# EAGLE design Arm_Driver (EAGLE 6.1)
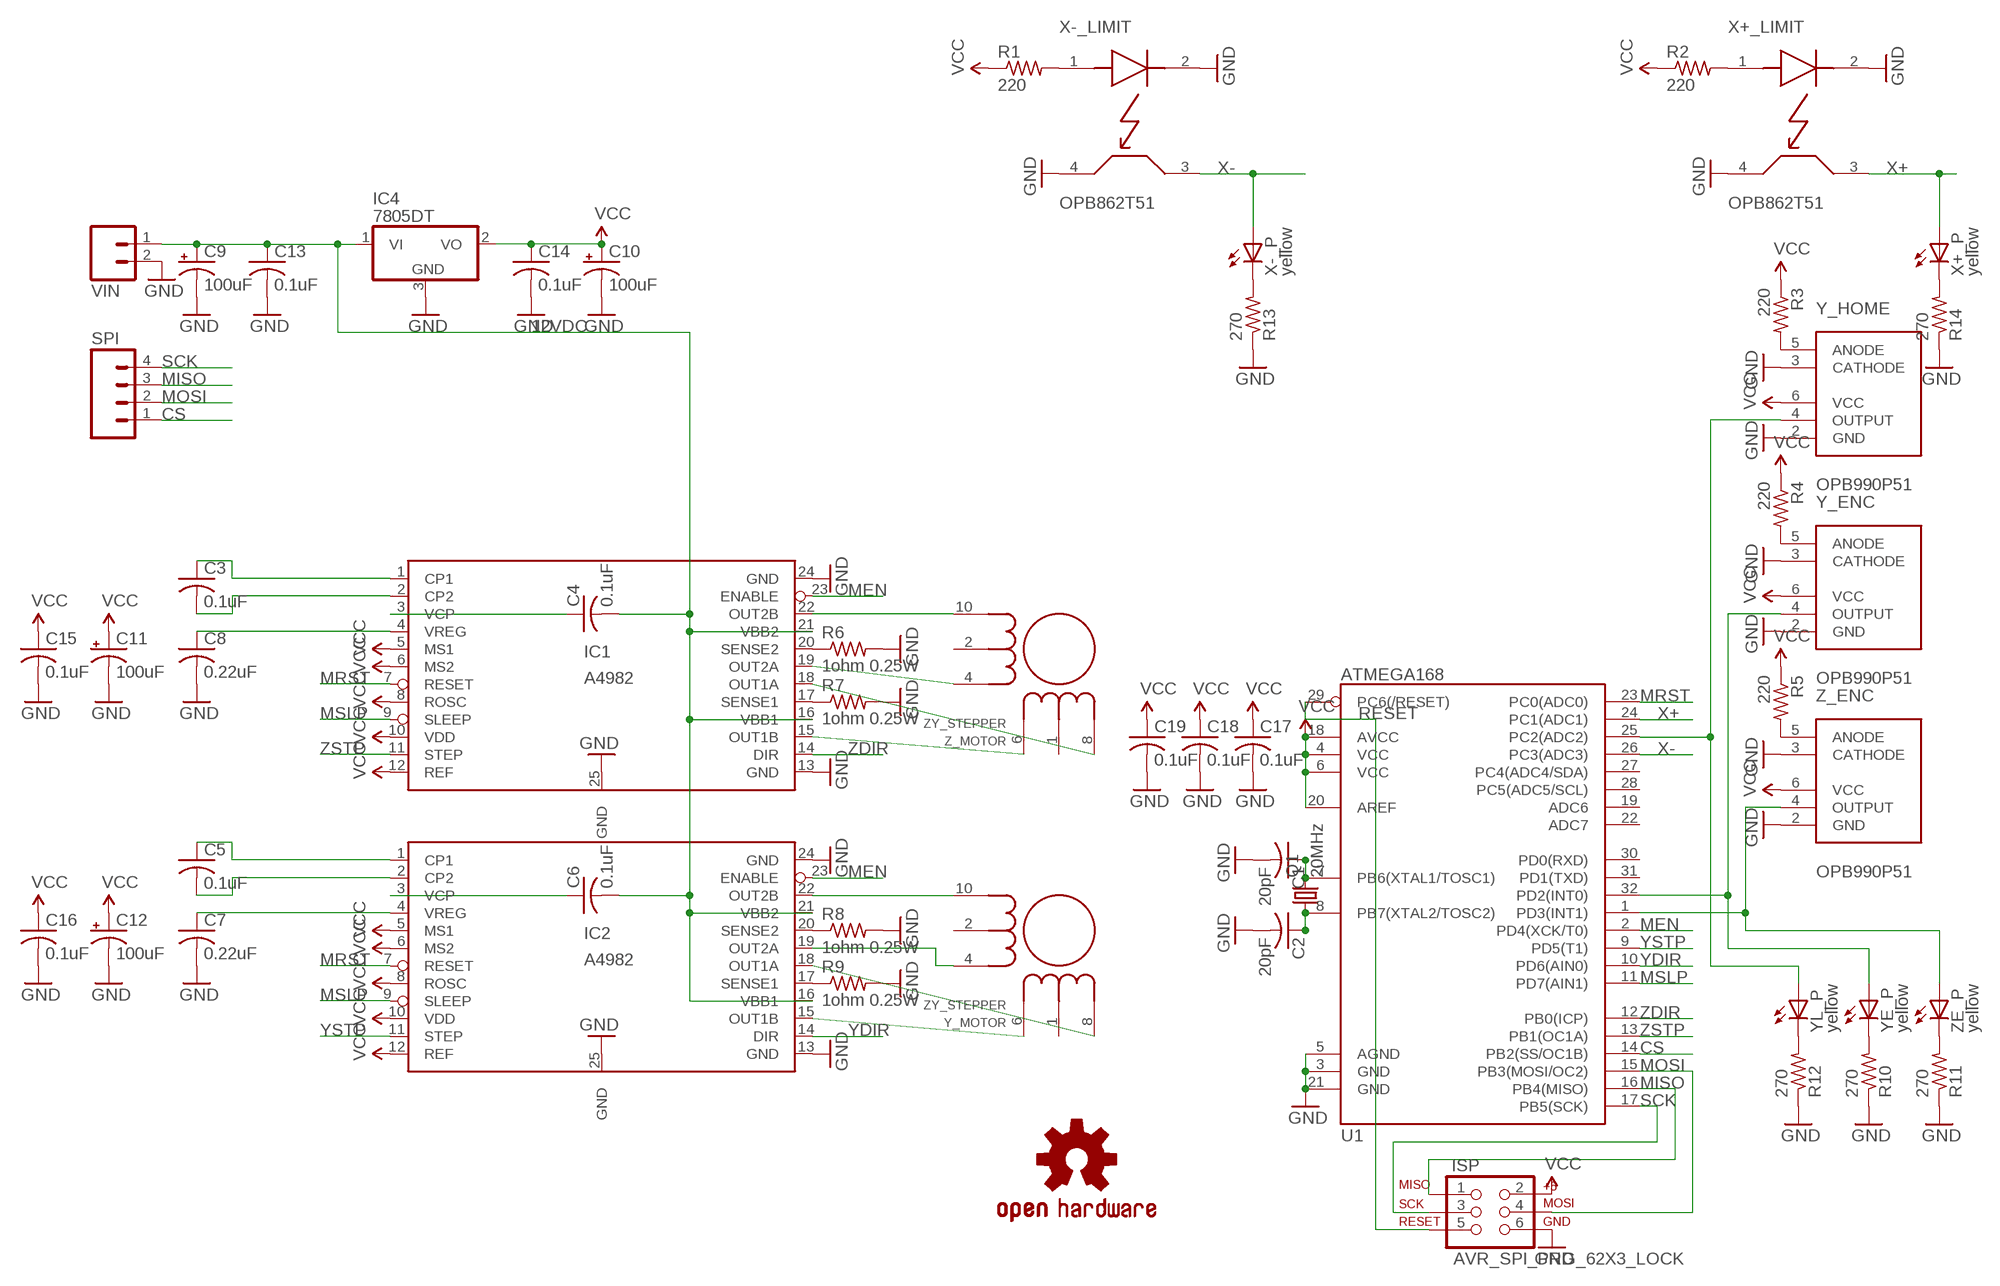
[diagram p0: schematic, sheet 1]

## Parts
C1  20pF  C-USC0603  [C0603]
C2  20pF  C-USC0603  [C0603]
C3  0.1uF  C-USC0603  [C0603]
C4  0.1uF  C-USC0603  [C0603]
C5  0.1uF  C-USC0603  [C0603]
C6  0.1uF  C-USC0603  [C0603]
C7  0.22uF  C-USC0603  [C0603]
C8  0.22uF  C-USC0603  [C0603]
C9  100uF  CPOL-US153CLV-0505  [153CLV-0505]
C10  100uF  CPOL-US153CLV-0505  [153CLV-0505]
C11  100uF  CPOL-US153CLV-0505  [153CLV-0505]
C12  100uF  CPOL-US153CLV-0505  [153CLV-0505]
C13  0.1uF  C-USC0603  [C0603]
C14  0.1uF  C-USC0603  [C0603]
C15  0.1uF  C-USC0603  [C0603]
C16  0.1uF  C-USC0603  [C0603]
C17  0.1uF  C-USC0603  [C0603]
C18  0.1uF  C-USC0603  [C0603]
C19  0.1uF  C-USC0603  [C0603]
IC1  A4982  [24TSSOP]
IC2  A4982  [24TSSOP]
IC4  7805DT  [TO252]
ISP  AVR_SPI_PRG_62X3_LOCK  [2X3_LOCK]
Q1  20MHz  CRYSTALHC49UP  [HC49UP]
R1  220  R-US_R0603  [R0603]
R2  220  R-US_R0603  [R0603]
R3  220  R-US_R0603  [R0603]
R4  220  R-US_R0603  [R0603]
R5  220  R-US_R0603  [R0603]
R6  1ohm 0.25W  R-US_R0603  [R0603]
R7  1ohm 0.25W  R-US_R0603  [R0603]
R8  1ohm 0.25W  R-US_R0603  [R0603]
R9  1ohm 0.25W  R-US_R0603  [R0603]
R10  270  R-US_R0603  [R0603]
R11  270  R-US_R0603  [R0603]
R12  270  R-US_R0603  [R0603]
R13  270  R-US_R0603  [R0603]
R14  270  R-US_R0603  [R0603]
SPI  M04LOCK  [1X04_LOCK]
U1  ATMEGA168  [TQFP32-08]
U$1  OSHW-LOGOM  [OSHW-LOGO-M]
VIN  M025MM  [SCREWTERMINAL-5MM-2]
X+_LIMIT  OPB862T51  [OPB862T51]
X+_P  yellow  LEDCHIP-LED0603  [CHIP-LED0603]
X-_LIMIT  OPB862T51  [OPB862T51]
X-_P  yellow  LEDCHIP-LED0603  [CHIP-LED0603]
Y_ENC  OPB990P51  [OPB990P51]
Y_HOME  OPB990P51  [OPB990P51]
Y_MOTOR  ZY_STEPPER  [2X5_SHROUDED]
YE_P  yellow  LEDCHIP-LED0603  [CHIP-LED0603]
YL_P  yellow  LEDCHIP-LED0603  [CHIP-LED0603]
Z_ENC  OPB990P51  [OPB990P51]
Z_MOTOR  ZY_STEPPER  [2X5_SHROUDED]
ZE_P  yellow  LEDCHIP-LED0603  [CHIP-LED0603]

## Nets
12VDC: C4.2 C6.2 C9.+ C13.1 IC1.16(VBB1) IC1.21(VBB2) IC2.16(VBB1) IC2.21(VBB2) IC4.1(VI) VIN.1
CS: SPI.1 U1.14(PB2(SS/OC1B))
GND: C1.2 C2.2 C7.2 C8.2 C9.- C10.- C11.- C12.- C13.2 C14.2 C15.2 C16.2 C17.2 C18.2 C19.2 IC1.13(GND) IC1.24(GND) IC1.25(GND) IC2.13(GND) IC2.24(GND) IC2.25(GND) IC4.3(GND) ISP.6 R6.2 R7.2 R8.2 R9.2 R10.1 R11.1 R12.1 R13.1 R14.1 U1.3(GND) U1.5(AGND) U1.21(GND) VIN.2 X+_LIMIT.2(CATHODE) X+_LIMIT.4(EMITTER) X-_LIMIT.2(CATHODE) X-_LIMIT.4(EMITTER) Y_ENC.2(GND) Y_ENC.3(CATHODE) Y_HOME.2(GND) Y_HOME.3(CATHODE) Z_ENC.2(GND) Z_ENC.3(CATHODE)
MEN: IC1.23(ENABLE) IC2.23(ENABLE) U1.2(PD4(XCK/T0))
MISO: ISP.1 SPI.3 U1.16(PB4(MISO))
MOSI: ISP.4 SPI.2 U1.15(PB3(MOSI/OC2))
MRST: IC1.7(RESET) IC2.7(RESET) U1.23(PC0(ADC0))
MSLP: IC1.9(SLEEP) IC2.9(SLEEP) U1.11(PD7(AIN1))
N$1: C1.1 Q1.2 U1.7(PB6(XTAL1/TOSC1))
N$2: C2.1 Q1.1 U1.8(PB7(XTAL2/TOSC2))
N$3: R1.2 X-_LIMIT.1(ANODE)
N$4: R2.2 X+_LIMIT.1(ANODE)
N$5: R3.2 Y_HOME.5(ANODE)
N$6: R4.2 Y_ENC.5(ANODE)
N$7: R5.2 Z_ENC.5(ANODE)
N$8: IC1.18(OUT1A) Z_MOTOR.8(A1)
N$9: U1.1(PD3(INT1)) Z_ENC.4(OUTPUT) ZE_P.A
N$10: U1.32(PD2(INT0)) Y_ENC.4(OUTPUT) YE_P.A
N$11: U1.25(PC2(ADC2)) Y_HOME.4(OUTPUT) YL_P.A
N$12: C5.1 IC2.1(CP1)
N$13: C5.2 IC2.2(CP2)
N$14: C3.1 IC1.1(CP1)
N$15: C3.2 IC1.2(CP2)
N$16: C4.1 IC1.3(VCP)
N$17: IC1.15(OUT1B) Z_MOTOR.6(A2)
N$18: C6.1 IC2.3(VCP)
N$19: IC1.19(OUT2A) Z_MOTOR.4(B1)
N$20: C8.1 IC1.4(VREG)
N$21: C7.1 IC2.4(VREG)
N$22: IC1.22(OUT2B) Z_MOTOR.10(B2)
N$23: IC2.18(OUT1A) Y_MOTOR.8(A1)
N$24: IC2.15(OUT1B) Y_MOTOR.6(A2)
N$25: IC2.22(OUT2B) Y_MOTOR.10(B2)
N$26: IC2.19(OUT2A) Y_MOTOR.4(B1)
N$29: IC1.20(SENSE2) R6.1
N$30: IC1.17(SENSE1) R7.1
N$31: IC2.20(SENSE2) R8.1
N$32: IC2.17(SENSE1) R9.1
N$33: R10.2 YE_P.C
N$35: R11.2 ZE_P.C
N$37: R12.2 YL_P.C
N$38: R13.2 X-_P.C
N$40: R14.2 X+_P.C
RESET: ISP.5 U1.29(PC6(/RESET))
SCK: ISP.3 SPI.4 U1.17(PB5(SCK))
VCC: C10.+ C11.+ C12.+ C14.1 C15.1 C16.1 C17.1 C18.1 C19.1 IC1.5(MS1) IC1.6(MS2) IC1.8(ROSC) IC1.10(VDD) IC1.12(REF) IC2.5(MS1) IC2.6(MS2) IC2.8(ROSC) IC2.10(VDD) IC2.12(REF) IC4.2(VO) ISP.2 R1.1 R2.1 R3.1 R4.1 R5.1 U1.4(VCC) U1.6(VCC) U1.18(AVCC) U1.20(AREF) Y_ENC.6(VCC) Y_HOME.6(VCC) Z_ENC.6(VCC)
X+: U1.24(PC1(ADC1)) X+_LIMIT.3(COLLECTOR) X+_P.A
X-: U1.26(PC3(ADC3)) X-_LIMIT.3(COLLECTOR) X-_P.A
YDIR: IC2.14(DIR) U1.10(PD6(AIN0))
YSTP: IC2.11(STEP) U1.9(PD5(T1))
ZDIR: IC1.14(DIR) U1.12(PB0(ICP))
ZSTP: IC1.11(STEP) U1.13(PB1(OC1A))
Unconnected: U1.19(ADC6) U1.22(ADC7) U1.27(PC4(ADC4/SDA)) U1.28(PC5(ADC5/SCL)) U1.30(PD0(RXD)) U1.31(PD1(TXD)) Y_MOTOR.1(CA) Y_MOTOR.2(CB) Z_MOTOR.1(CA) Z_MOTOR.2(CB)

## Library data of the parts
C1-C8 C13-C19 = rcl:C-US: CAPACITOR, American symbol
C9-C12 = rcl:CPOL-US: POLARIZED CAPACITOR, American symbol
IC1 IC2 = i3_Pick_Place:A4982: Allegro A4982 microstepping driver
IC4 = linear:78*: Positive VOLTAGE REGULATOR Source: http://cache.national.com/ds/LM/LM78L05.pdf http://www.fairchildsemi.com/ds/LM/LM7805.pdf
ISP = SparkFun:AVR_SPI_PRG_6: AVR ISP 6 Pin This is the reduced ISP connector for AVR programming. Common on Arduino. This footprint will take up less PCB space and can be used with a 10-pin to 6-pin adapter such as SKU: BOB-08508
Q1 = crystal:CRYSTAL: CRYSTAL; OC_FARNELL: unknown; OC_NEWARK: unknown
R1-R14 = rcl:R-US_: RESISTOR, American symbol
SPI = SparkFun:M04: Header 4 Standard 4-pin 0.1" header. Use with straight break away headers (SKU : PRT-00116), right angle break away headers (PRT-00553), swiss pins (PRT-00743), machine pins (PRT-00117), and female headers (PRT-00115). Molex polarized connector foot print use with SKU : PRT-08231 with associated crimp pins and housings. 1MM SMD Version SKU: PRT-10208
U1 = SparkFun:ATMEGA168
U$1 = SparkFun:OSHW-LOGO: Open Source Hardware Logo This logo indicates the piece of hardware it is found on incorporates a OSHW license and/or adheres to the definition of open source hardware found here: http://freedomdefined.org/OSHW
VIN = SparkFun:M02: Header 2 Standard 2-pin 0.1" header. Use with straight break away headers (SKU : PRT-00116), right angle break away headers (PRT-00553), swiss pins (PRT-00743), machine pins (PRT-00117), and female headers (PRT-00115). Molex polarized connector foot print use with SKU : PRT-08233 with associated crimp pins and housings.
X+_LIMIT X-_LIMIT = i3_Pick_Place:OPB862T51: Optek OPB862T51 PCB-mount IR opto-interrupter
X+_P X-_P YE_P YL_P ZE_P = adafruit:LED: LED OSRAM: - CHIPLED LG R971, LG N971, LY N971, LG Q971, LY Q971, LO R971, LY R971 LH N974, LH R974 LS Q976, LO Q976, LY Q976 LO Q996 - Hyper CHIPLED LW Q18S LB Q993, LB Q99A, LB R99A - SideLED LS A670, LO A670, LY A670, LG A670, LP A670 LB A673, LV A673, LT A673, LW A673 LH A674 LY A675 LS A676, LA A676, LO A676, LY A676, LW A676 LS A679, LY A679, LG A679 - Hyper Micro SIDELED® LS Y876, LA Y876, LO Y876, LY Y876 LT Y87S - SmartLED LW L88C, LW L88S LB L89C, LB L89S, LG L890 LS L89K, LO L89K, LY L89K LS L896, LA L896, LO L896, LY L896 - TOPLED LS T670, LO T670, LY T670, LG T670, LP T670 LSG T670, LSP T670, LSY T670, LOP T670, LYG T670 LG T671, LOG T671, LSG T671 LB T673, LV T673, LT T673, LW T673 LH T674 LS T676, LA T676, LO T676, LY T676, LB T676, LH T676, LSB T676, LW T676 LB T67C, LV T67C, LT T67C, LS T67K, LO T67K, LY T67K, LW E67C LS E67B, LA E67B, LO E67B, LY E67B, LB E67C, LV E67C, LT E67C LW T67C LS T679, LY T679, LG T679 LS T770, LO T770, LY T770, LG T770, LP T770 LB T773, LV T773, LT T773, LW T773 LH T774 LS E675, LA E675, LY E675, LS T675 LS T776, LA T776, LO T776, LY T776, LB T776 LHGB T686 LT T68C, LB T68C - Hyper Mini TOPLED® LB M676 - Mini TOPLED Santana® LG M470 LS M47K, LO M47K, LY M47K Source: http://www.osram.convergy.de/
Y_ENC Y_HOME Z_ENC = i3_Pick_Place:OPB990P51: Optek OPB990P51 flying-lead IR opto-interrupter
Y_MOTOR Z_MOTOR = i3_Pick_Place:ZY_STEPPER: Pinout for Z and Y steppers

## Board
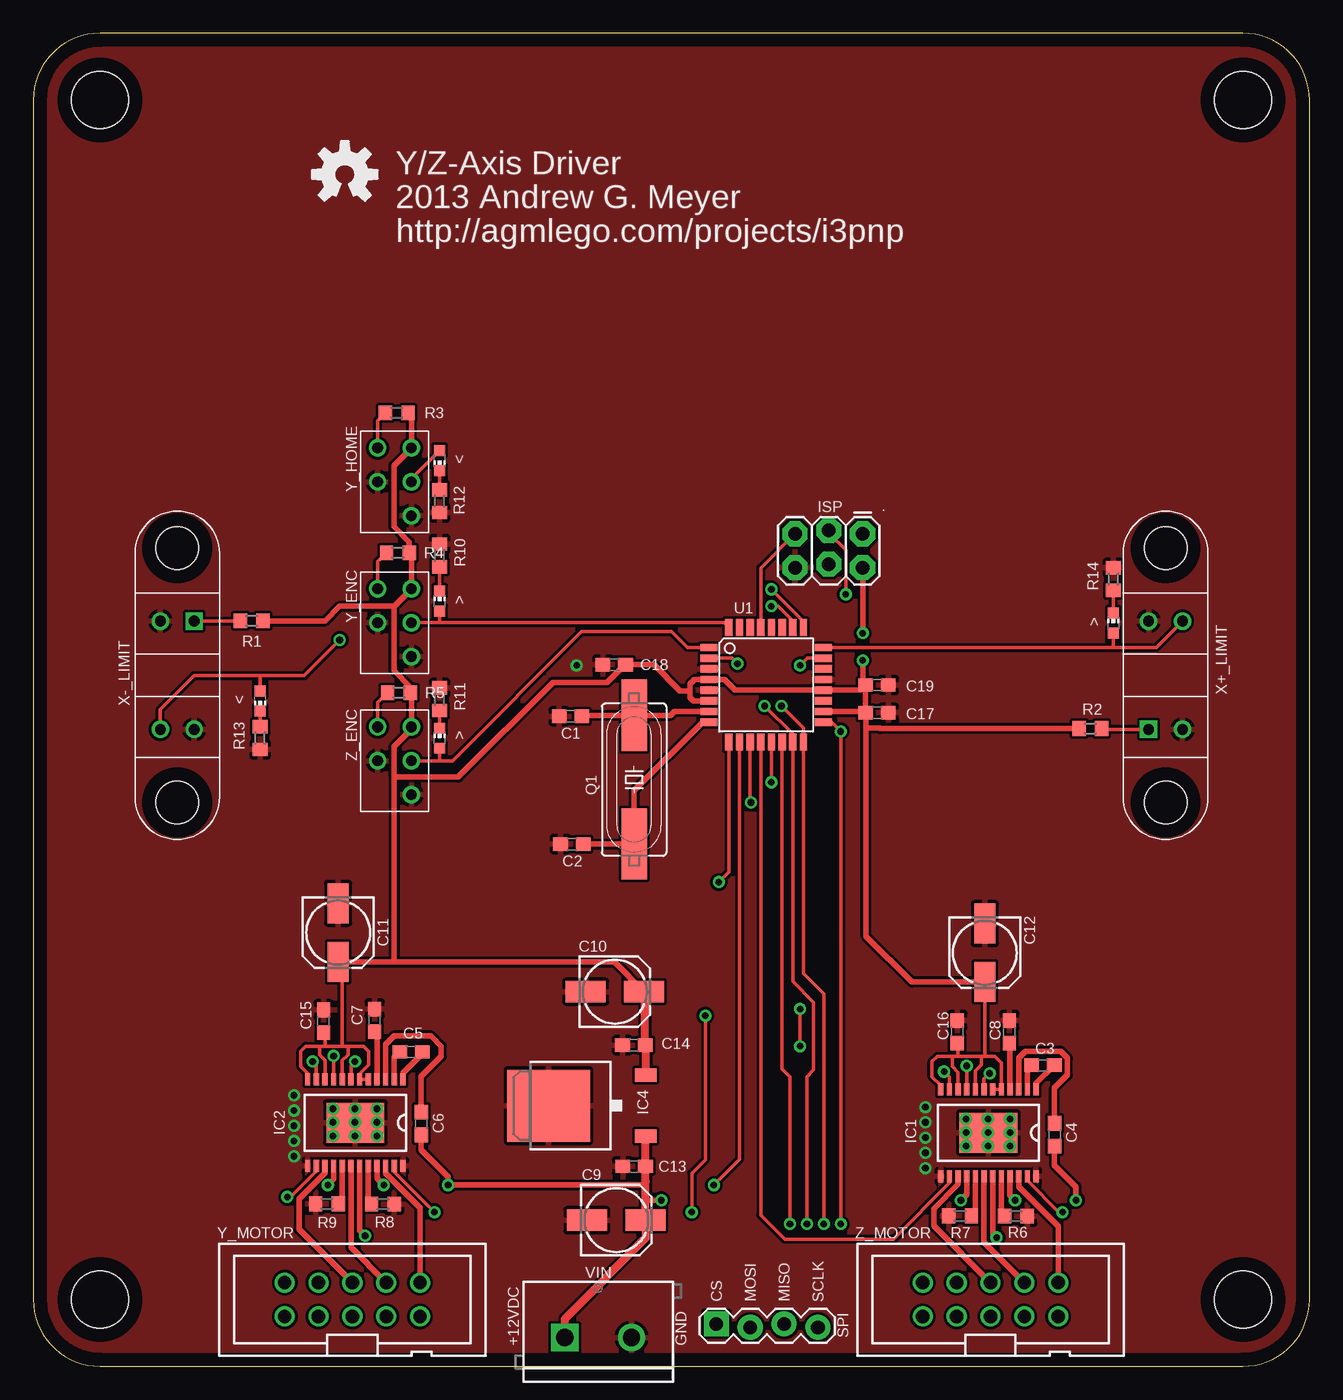
[diagram p1: board, top side]
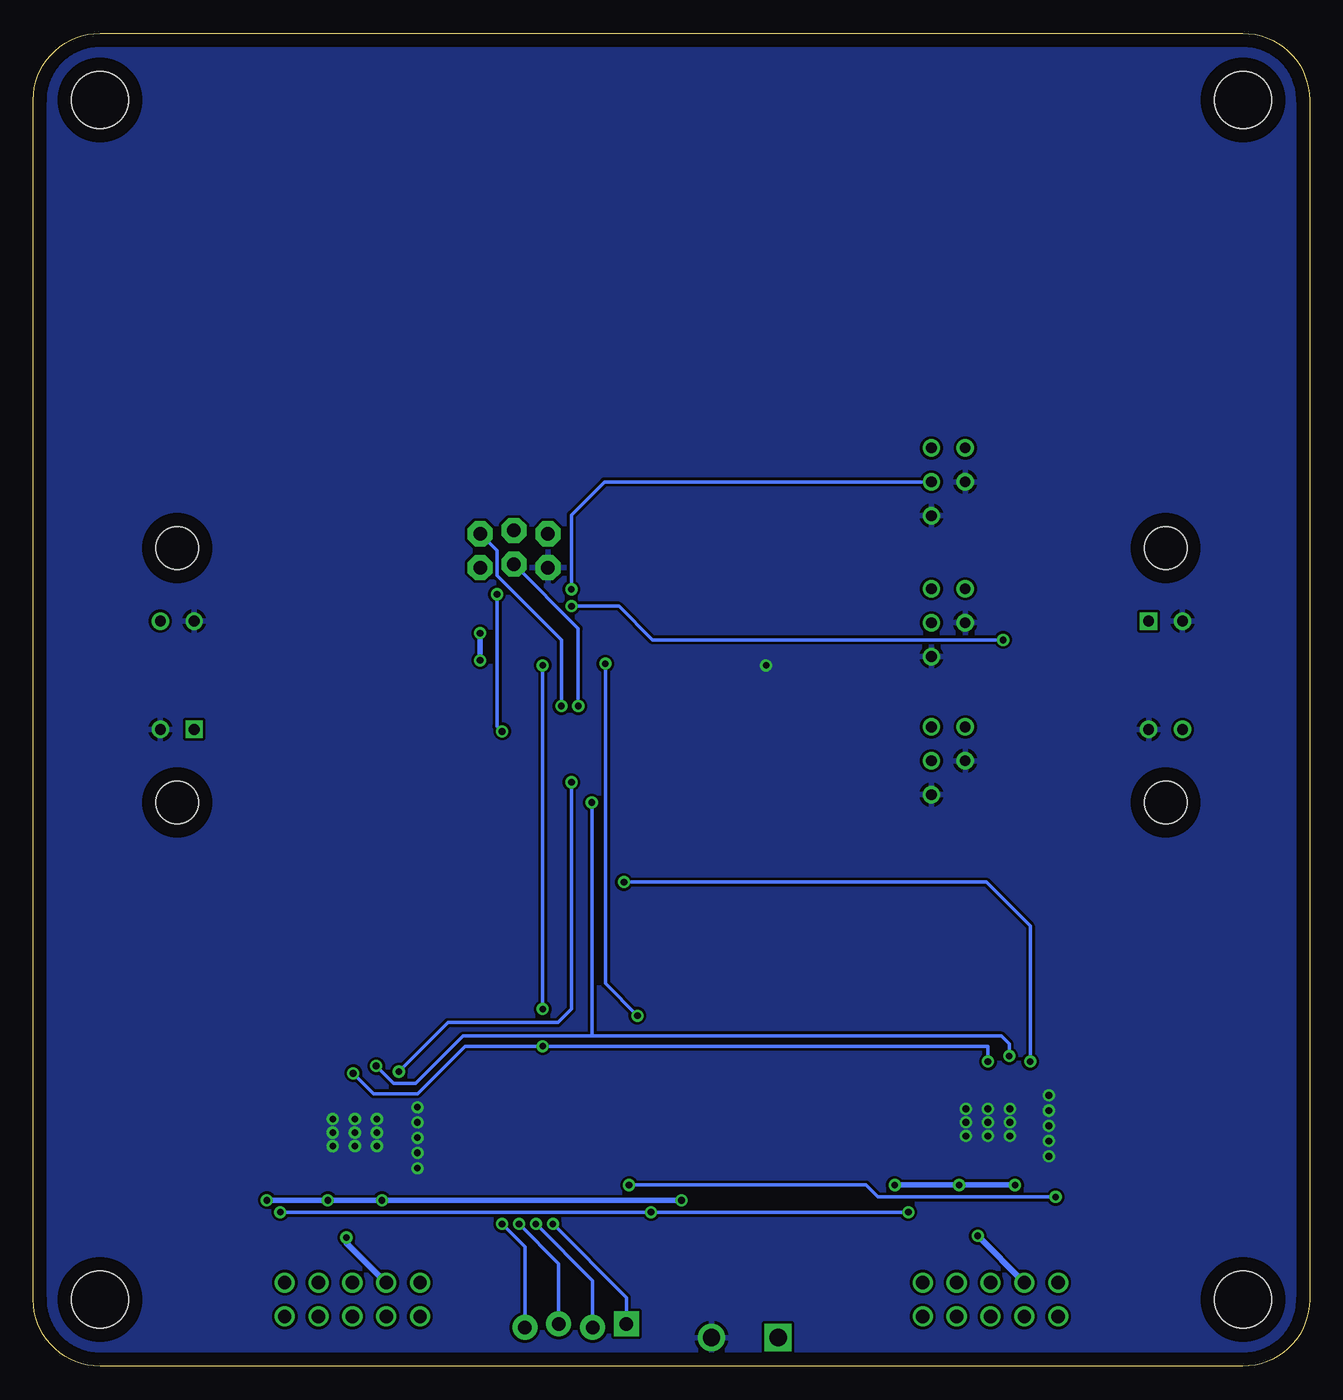
[diagram p2: board, bottom side, seen from below]

Size 95.75 x 100 mm. Coordinates in mm from the lower left corner, seen from the top.
Outline: 0,95 0,5 arc90 5,0 90.75,0 arc90 95.75,5 95.75,95 arc90 90.75,100 5,100 arc90 0,95
Copper layers (1*16): Top 0.035mm / dielectric 1.5mm / Bottom 0.035mm
Design rules: minimum track width 10mil, minimum drill 24mil, track to track 8mil, track to pad 8mil, pad to pad 8mil, via to via 8mil, smd to smd 8mil, copper to edge 40mil, drill to drill 8mil, minimum pad ring 10mil, minimum via ring 8mil, stop-mask expansion 4mil, vias tented up to drill 0mil, thermal gap 10mil
Holes 4.3 mm at 5,5 90.75,5 90.75,95 5,95

### Footprints (pad centres in the part's own frame; a part is rotated, then mirrored left to right if it is on the bottom)
C0603 = smd 1.1 x 1: 1 -0.85,0; 2 0.85,0
153CLV-0505 = smd 3 x 1.6: + 2.2,0; - -2.2,0
24TSSOP = smd 0.9 x 0.4: 1 -3.25,3.575; 2 -3.25,2.925; 3 -3.25,2.275; 4 -3.25,1.625; 5 -3.25,0.975; 6 -3.25,0.325; 7 -3.25,-0.325; 8 -3.25,-0.975; 9 -3.25,-1.625; 10 -3.25,-2.275; 11 -3.25,-2.925; 12 -3.25,-3.575; 13 3.25,-3.575; 14 3.25,-2.925; 15 3.25,-2.275; 16 3.25,-1.625; 17 3.25,-0.975; 18 3.25,-0.325; 19 3.25,0.325; 20 3.25,0.975; 21 3.25,1.625; 22 3.25,2.275; 23 3.25,2.925; 24 3.25,3.575 | smd 3 x 4.32: 25 0,0
TO252 = smd 1 x 1.6: 1 -2.28,-4.8; 2 2.28,-4.8 | smd 5.4 x 6.2: 3 0,2.5
2X3_LOCK = drill 1.016 pad 1.88 octagon: 1 0,0; 2 0,2.54; 3 2.54,-0.254; 4 2.54,2.286; 5 5.08,0; 6 5.08,2.54
HC49UP = smd 5.334 x 1.93: 1 -4.826,0; 2 4.826,0
R0603 = smd 1 x 1.1: 1 -0.85,0; 2 0.85,0
1X04_LOCK = drill 1.016 pad 1.88 square: 1 0,0.127 | drill 1.016 pad 1.88: 2 2.54,-0.127; 3 5.08,0.127; 4 7.62,-0.127
TQFP32-08 = smd 1.27 x 0.559: 1 -4.293,2.8; 2 -4.293,2; 3 -4.293,1.2; 4 -4.293,0.4; 5 -4.293,-0.4; 6 -4.293,-1.2; 7 -4.293,-2; 8 -4.293,-2.8; 17 4.293,-2.8; 18 4.293,-2; 19 4.293,-1.2; 20 4.293,-0.4; 21 4.293,0.4; 22 4.293,1.2; 23 4.293,2; 24 4.293,2.8 | smd 0.559 x 1.27: 9 -2.8,-4.293; 10 -2,-4.293; 11 -1.2,-4.293; 12 -0.4,-4.293; 13 0.4,-4.293; 14 1.2,-4.293; 15 2,-4.293; 16 2.8,-4.293; 25 2.8,4.293; 26 2,4.293; 27 1.2,4.293; 28 0.4,4.293; 29 -0.4,4.293; 30 -1.2,4.293; 31 -2,4.293; 32 -2.8,4.293
SCREWTERMINAL-5MM-2 = drill 1.3 pad 2.032 square: 1 0,0 | drill 1.3 pad 2.032: 2 5,0
OPB862T51 = drill 0.8 square: 1 4.064,-1.27 | drill 0.8: 2 4.064,1.27; 3 -4.064,1.27; 4 -4.064,-1.27 | hole 3.2: -9.538,0; 9.538,0
CHIP-LED0603 = smd 0.8 x 0.8: A 0,-0.75; C 0,0.75
OPB990P51 = drill 0.8: 2 -2.54,-1.27; 3 0,1.27; 4 0,-1.27; 5 2.54,1.27; 6 2.54,-1.27
2X5_SHROUDED = drill 1 pad 1.422: 1 -5.08,-1.27; 2 -5.08,1.27; 3 -2.54,-1.27; 4 -2.54,1.27; 5 0,-1.27; 6 0,1.27; 7 2.54,-1.27; 8 2.54,1.27; 9 5.08,-1.27; 10 5.08,1.27

### Placement (x,y rotation side)
C1  40.31,48.76 180 top
C2  40.41,39.17 180 top
C3  75.76,22.58 180 top
C4  76.62,17.37 270 top
C5  28.34,23.59 180 top
C6  29.11,18.2 270 top
C7  25.61,25.95 90 top
C8  73.23,25.08 90 top
C9  43.74,10.96 0 top
C10  43.63,28.09 0 top
C11  22.87,32.53 270 top
C12  71.39,31.02 270 top
C13  45.08,14.99 180 top
C14  45.06,24.09 180 top
C15  21.78,25.88 90 top
C16  69.32,25.09 90 top
C17  63.3,49.03 0 top
C18  43.58,52.63 180 top
C19  63.3,51.1 0 top
IC1  71.66,17.51 270 top
IC2  24.16,18.27 270 top
IC4  41.15,19.55 90 top
ISP  62.23,62.45 180 top
Q1  45.08,44.01 90 top
R1  16.38,55.92 180 top
R2  79.31,47.84 0 top
R3  27.27,71.53 180 top
R4  27.35,61.03 180 top
R5  27.43,50.53 180 top
R6  73.72,11.26 0 top
R7  69.53,11.28 180 top
R8  26.23,12.16 0 top
R9  22.03,12.18 180 top
R10  30.48,60.83 270 top
R11  30.48,50.04 270 top
R12  30.48,64.9 90 top
R13  17.02,47.12 90 top
R14  81.03,59.05 270 top
SPI  51.25,3.04 0 top
U1  54.98,51.12 0 top
U$1  23.37,89.41 0 top
VIN  39.88,2.15 0 top
X+_LIMIT  84.95,51.84 270 top
X+_P  81.03,55.75 0 top
X-_LIMIT  10.8,51.84 90 top
X-_P  17.02,49.91 180 top
Y_ENC  27.1,55.78 90 top
Y_HOME  27.1,66.35 90 top
Y_MOTOR  23.94,5 0 top
YE_P  30.48,57.4 0 top
YL_P  30.48,67.94 180 top
Z_ENC  27.1,45.42 90 top
Z_MOTOR  71.81,5 0 top
ZE_P  30.48,47.12 0 top

### Tracks (layer width: path | path; a pad name or v marks a point on that pad's centre or on a via)
12VDC  (via drill 0.5, 0.5 pad 0.25)
  Top 0.406: IC2.16 22.54,14.03 v22.1,13.59 | v26.29,13.59 25.79,14.09 IC2.21 | 45.94,13.84 45.69,13.59 v31.11,13.59 31.11,14.22 29.11,16.23 C6.2 | IC1.21 73.28,12.82 v73.66,12.45 | v69.6,12.45 70.03,12.88 IC1.16 | v47.12,12.45 45.94,12.45 | C4.2 76.62,15.07 78.23,13.46 v78.23,12.45
  Top 0.61: VIN.1 39.88,3.55 45.94,9.62 C9.+ 45.94,12.45 45.94,13.84 45.94,14.98 C13.1 45.93,17.25 IC4.1
  Bottom 0.406: v22.1,13.59 v26.29,13.59 v31.11,13.59 | v47.12,12.45 v69.6,12.45 v73.66,12.45 v78.23,12.45
CS  (via drill 0.5)
  Top 0.254: v56.77,10.67 56.77,21.72 56.18,22.31 U1.14
  Bottom 0.254: SPI.1 51.25,5.15 v56.77,10.67
GND  (via drill 0.5)
  other vias: 22.48,19.3 24.13,19.3 25.78,19.3 25.78,18.29 24.13,18.29 22.48,18.29 22.48,17.27 24.13,17.27 25.78,17.27 19.56,20.32 19.56,19.18 19.56,18.03 19.56,16.89 19.56,15.75 40.77,52.58 66.93,19.43 66.93,18.29 66.93,17.14 66.93,16 66.93,14.86 69.98,18.54 73.28,18.54 73.28,16.51 69.98,16.51 69.98,17.53 71.63,18.54 73.28,17.53 71.63,16.51 71.63,17.53
  pour Top: 0,0 95.75,0 95.75,100 0,100
  pour Bottom: 0,0 95.75,0 95.75,100 0,100
MEN  (via drill 0.5, 0.5 pad 0.25)
  Top 0.254: IC2.23 27.09,14.57 v30.1,11.56 | IC1.23 74.58,13.93 76.96,11.56 v77.22,11.56 | U1.2 52.42,53.12 v52.83,52.7 | v50.42,26.29 50.42,15.49 49.4,14.48 v49.4,11.56
  Bottom 0.254: v77.22,11.56 v49.4,11.56 v30.1,11.56 | v52.83,52.7 52.83,28.7 v50.42,26.29
MISO  (via drill 0.5)
  Top 0.254: v59.31,10.67 59.31,27.94 57.78,29.47 U1.16 57.78,47.88 v56.13,49.53
  Bottom 0.254: SPI.3 56.33,7.69 v59.31,10.67 | v56.13,49.53 56.13,54.48 60.96,59.31 60.96,61.19 ISP.1
MOSI  (via drill 0.5)
  Top 0.254: v58.04,10.67 58.04,21.72 58.55,22.23 58.55,27.3 56.98,28.87 U1.15 56.98,47.41 v54.86,49.53
  Bottom 0.254: SPI.2 53.79,6.42 v58.04,10.67 | v54.86,49.53 54.86,55.34 ISP.4
MRST  (via drill 0.5, 0.5 pad 0.25)
  Top 0.254: IC2.7 23.84,22.57 v24.13,22.86 | IC1.7 71.33,21.55 v71.75,21.97 | U1.23 58.07,53.12 v57.53,52.58 | v57.53,26.8 v57.53,24
  Bottom 0.254: v24.13,22.86 24.13,24 v57.53,24 63.37,24 66.93,20.45 70.23,20.45 v71.75,21.97 | v57.53,52.58 v57.53,26.8
MSLP  (via drill 0.5, 0.5 pad 0.25)
  Top 0.254: IC2.9 v22.54,23.26 v22.53,23.27 | IC1.9 v70.03,22.52 v70.03,22.53 | U1.11 53.78,42.36 v53.85,42.29
  Bottom 0.254: v70.03,22.53 68.71,21.21 67.06,21.21 63.5,24.77 53.85,24.77 | v53.85,42.29 53.85,24.77 | v22.53,23.27 22.53,24.18 23.11,24.77 53.85,24.77
N$1
  Top 0.406: C1.1 41.23,48.84 Q1.2 47.82,48.84 48.1,49.12 U1.7
N$2
  Top 0.406: U1.8 50.23,48.32 45.09,43.18 Q1.1 C2.1
N$3
  Top 0.254: X-_LIMIT.1 15.51,55.9 R1.2
N$4
  Top 0.254: X+_LIMIT.1 80.23,47.77 R2.2
N$5
  Top 0.254: Y_HOME.5 25.83,70.94 R3.2
N$6
  Top 0.254: Y_ENC.5 25.83,60.36 R4.2
N$7
  Top 0.254: Z_ENC.5 25.83,49.78 R5.2
N$8
  Top 0.406: IC1.18 71.33,9.29 Z_MOTOR.8
N$9
  Top 0.254: Z_ENC.4 30.48,45.42 | 30.48,45.42 31.45,45.42 41.15,55.12 47.88,55.12 49.08,53.92 U1.1 | ZE_P.A 30.48,45.42
N$10
  Top 0.254: Y_ENC.4 30.61,55.78 | 30.61,55.78 51.81,55.78 U1.32 | YE_P.A 30.48,55.91 30.61,55.78
N$11  (via drill 0.5)
  Top 0.254: 55.37,58.29 v55.38,58.28 57.78,55.88 U1.25 | Y_HOME.4 28.37,66.58 YL_P.A
  Bottom 0.254: Y_HOME.4 52.9,66.35 55.38,63.87 v55.38,58.28
N$12
  Top 0.406: C5.1 29.19,23.47 27.73,22.02 IC2.1
N$13
  Top 0.406: C5.2 27.09,23.18 IC2.2
N$14
  Top 0.406: IC1.1 75.23,21.2 C3.1
N$15
  Top 0.406: IC1.2 74.58,22.25 C3.2
N$16
  Top 0.406: C4.1 76.62,20.87 77.6,21.84 77.6,23.11 77.09,23.62 74.42,23.62 73.94,23.14 IC1.3
N$17
  Top 0.406: IC1.15 69.39,13.63 67.56,11.81 67.56,10.52 Z_MOTOR.6
N$18
  Top 0.406: C6.1 29.11,21.75 30.61,23.24 30.61,24 29.84,24.77 27.05,24.77 26.43,24.15 IC2.3
N$19  (via drill 0.5)
  Top 0.406: IC1.19 71.98,9.93 v72.26,9.65
  Bottom 0.406: Z_MOTOR.4 72.26,9.26 v72.26,9.65
N$20
  Top 0.406: IC1.4 73.28,24.17 C8.1
N$21
  Top 0.406: IC2.4 25.79,24.93 C7.1
N$22
  Top 0.406: IC1.22 73.94,13.44 76.89,10.48 Z_MOTOR.10
N$23
  Top 0.406: IC2.18 23.84,8.91 Y_MOTOR.8
N$24
  Top 0.406: IC2.15 21.89,14.52 19.94,12.57 19.94,10.27 Y_MOTOR.6
N$25
  Top 0.406: IC2.22 26.43,14.46 29.02,11.88 Y_MOTOR.10
N$26  (via drill 0.5)
  Top 0.406: IC2.19 24.48,10.19 v24.89,9.78
  Bottom 0.406: v24.89,9.78 24.89,9.76 Y_MOTOR.4
N$29
  Top 0.406: R6.1 72.64,11.25 IC1.20
N$30
  Top 0.406: R7.1 70.69,11.33 IC1.17
N$31
  Top 0.406: IC2.20 25.14,12.4 R8.1
N$32
  Top 0.406: IC2.17 23.18,12.48 R9.1
N$33
  Top 0.254: YE_P.C R10.2
N$35
  Top 0.254: ZE_P.C R11.2
N$37
  Top 0.254: R12.2 YL_P.C
N$38
  Top 0.254: R13.2 X-_P.C
N$40
  Top 0.254: X+_P.C R14.2
RESET
  Top 0.254: U1.29 54.58,59.88 ISP.5
SCK  (via drill 0.5)
  Top 0.254: v60.58,10.67 v60.58,47.62 59.88,48.32 U1.17 | ISP.3 59.69,62.49 60.96,61.21 v60.96,57.91
  Bottom 0.254: SPI.4 58.87,8.96 v60.58,10.67 | v60.96,57.91 60.96,48.01 v60.58,47.62
VCC  (via drill 0.5)
  Top 0.254: 21.89,24.92 21.89,24 | 23.18,24 23.18,30.02 | IC2.5 IC2.6 24.48,21.95 25.15,22.61 25.15,23.62 24.77,24 23.62,24 | 23.62,24 23.18,24 | IC2.12 20.59,21.96 20.07,22.48 20.07,23.62 20.45,24 21.46,24 | 21.46,24 21.89,24 | 23.18,24 21.89,24 | IC2.10 21.89,22.95 21.46,23.37 21.46,24 | IC2.8 23.18,22.93 23.62,23.37 23.62,24 | 69.39,23.24 69.39,24.17 C16.1 | IC1.12 68.08,21.07 67.44,21.72 67.44,22.86 67.82,23.24 68.96,23.24 | 68.96,23.24 69.39,23.24 | 71.37,23.24 72.14,23.24 72.64,22.74 IC1.5 IC1.6 | 71.37,23.24 71.12,23.24 | 71.12,23.24 69.39,23.24 | IC1.8 70.69,22.17 71.12,22.61 71.12,23.24 | IC1.10 69.39,22.05 68.96,22.48 68.96,23.24 | C12.+ 71.39,23.26 71.37,23.24
  Top 0.406: C15.1 21.89,24.92 | 23.18,30.02 C11.+ 27.05,30.33 | 27.05,30.33 43.6,30.33 C10.+ | 27.05,44.32 27.05,46.48 28.37,47.8 Z_ENC.6 28.37,50.44 R5.1 28.28,50.97 27.05,52.2 27.05,57 | 27.05,44.32 27.05,30.33 | 27.05,57 Y_ENC.6 28.37,60.86 R4.1 28.2,61.84 27.05,62.99 27.05,67.57 Y_HOME.6 28.37,71.28 R3.1 | R1.1 21.88,55.92 22.99,57.02 27.03,57.02 27.05,57 | U1.6 49.52,49.92 49.28,50.16 49.28,50.67 | 49.28,50.67 49.28,51.18 49.62,51.52 U1.4 51.86,51.52 52.66,50.72 U1.20 62.06,50.72 C19.1 | 49.28,50.67 48.51,50.67 46.55,52.63 C18.1 44.38,52.63 43.05,51.31 38.99,51.31 31.88,44.2 27.18,44.2 27.05,44.32 | C12.+ 65.93,28.82 62.48,32.26 62.48,47.88 | 62.48,47.88 62.48,48.99 C17.1 | U1.18 62.35,49.12 C17.1 | C19.1 C17.1 | ISP.2 v62.23,54.99 | v62.23,52.96 62.23,51.32 C19.1 | R2.1 63.54,47.84 63.5,47.88 62.48,47.88
  Top 0.61: IC4.2 45.95,24.04 C14.1 45.91,28.02 C10.+
  Bottom 0.406: v62.23,54.99 v62.23,52.96
X+
  Top 0.254: X+_LIMIT.3 86.22,55.87 84.27,53.92 81.03,53.92 | X+_P.A 81.03,53.92 | U1.24 81.03,53.92
X-  (via drill 0.5)
  Top 0.254: X-_LIMIT.3 9.53,49.28 12.06,51.82 17.02,51.82 | 17.02,51.82 20.32,51.82 v22.99,54.48 | v55.37,57.02 55.88,57.02 56.98,55.92 U1.26 | X-_P.A 17.02,51.82
  Bottom 0.254: v22.99,54.48 49.28,54.48 51.82,57.02 v55.37,57.02
YDIR  (via drill 0.5)
  Top 0.254: U1.10 52.98,15.52 v51.05,13.59 | v19.05,12.7 19.3,12.7 21.23,14.63 IC2.14
  Bottom 0.254: v51.05,13.59 33.27,13.59 32.38,12.7 v19.05,12.7
YSTP  (via drill 0.5, 0.5 pad 0.25)
  Top 0.254: IC2.11 21.23,22.58 v20.95,22.86 | U1.9 52.18,37.07 v51.44,36.32
  Bottom 0.254: v51.44,36.32 24.26,36.32 20.95,33.02 v20.95,22.86
ZDIR
  Top 0.254: IC1.14 68.73,13.74 64.52,9.53 56.39,9.53 54.58,11.33 U1.12
ZSTP  (via drill 0.5)
  Top 0.254: IC1.11 68.73,21.69 v68.33,22.1 | v55.37,43.81 U1.13
  Bottom 0.254: v68.33,22.1 64.64,25.78 56.39,25.78 55.37,26.8 v55.37,43.81

### Text on the board
_tsilk: Y/Z-Axis Driver | 2013 Andrew G. Meyer | http://agmlego.com/projects/i3pnp | < | . | > | > | < | > | CS | MOSI | MISO | SCLK | +12VDC | GND